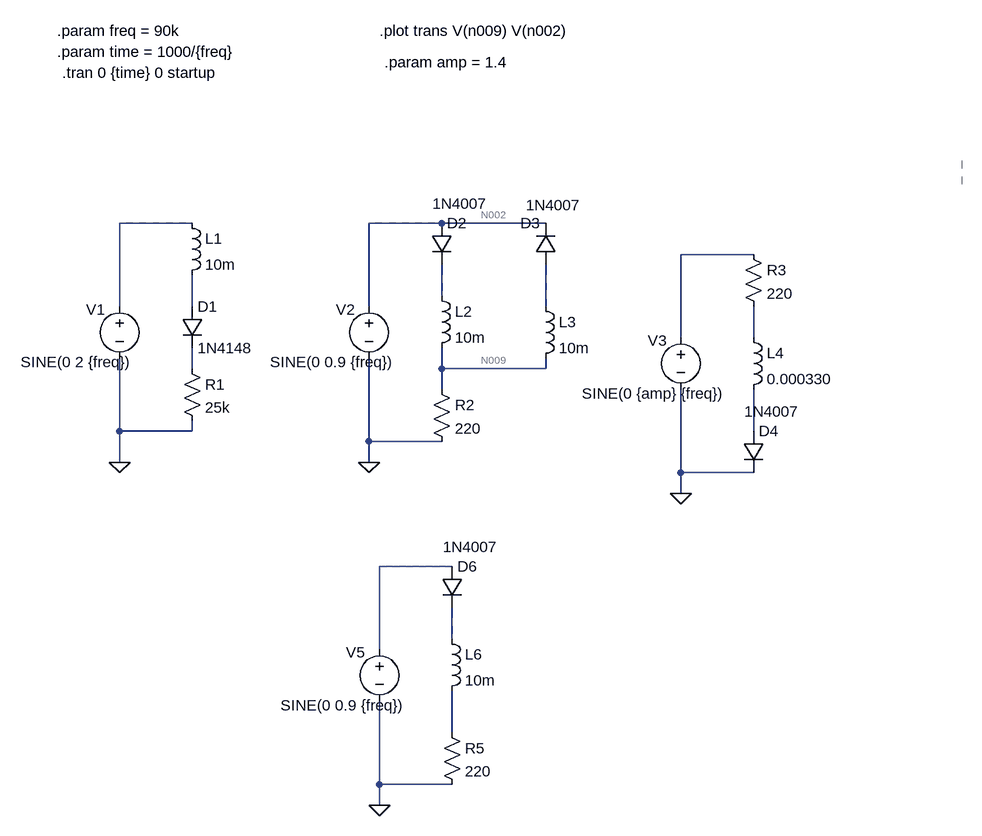
[diagram p0: schematic Draft1.asc]
Draft1.asc, the LTspice schematic file:
Version 4
SHEET 1 1500 1248
WIRE 272 272 160 272
WIRE 656 272 544 272
WIRE 816 272 656 272
WIRE 1136 320 1024 320
WIRE 656 384 656 336
WIRE 160 400 160 272
WIRE 272 400 272 352
WIRE 544 400 544 272
WIRE 816 400 816 336
WIRE 1024 448 1024 320
WIRE 1136 448 1136 400
WIRE 272 496 272 464
WIRE 656 496 656 464
WIRE 816 496 816 480
WIRE 816 496 656 496
WIRE 656 528 656 496
WIRE 160 592 160 480
WIRE 272 592 272 576
WIRE 272 592 160 592
WIRE 1136 592 1136 528
WIRE 544 608 544 480
WIRE 656 608 544 608
WIRE 160 640 160 592
WIRE 544 640 544 608
WIRE 1024 656 1024 528
WIRE 1136 656 1024 656
WIRE 1024 688 1024 656
WIRE 672 800 560 800
WIRE 672 912 672 864
WIRE 560 928 560 800
WIRE 672 1056 672 992
WIRE 560 1136 560 1008
WIRE 672 1136 560 1136
WIRE 560 1168 560 1136
FLAG 160 640 0
FLAG 544 640 0
FLAG 1024 688 0
FLAG 560 1168 0
SYMBOL diode 256 400 R0
SYMATTR InstName D1
SYMATTR Value 1N4148
SYMBOL res 256 480 R0
SYMATTR InstName R1
SYMATTR Value 25k
SYMBOL ind 256 256 R0
SYMATTR InstName L1
SYMATTR Value 10m
SYMBOL voltage 160 384 R0
WINDOW 0 -51 21 Left 2
WINDOW 3 -152 102 Left 2
SYMATTR InstName V1
SYMATTR Value SINE(0 2 {freq})
SYMBOL diode 640 272 R0
WINDOW 3 2 -30 Left 2
SYMATTR Value 1N4007
SYMATTR InstName D2
SYMBOL res 640 512 R0
SYMATTR InstName R2
SYMATTR Value 220
SYMBOL ind 640 368 R0
SYMATTR InstName L2
SYMATTR Value 10m
SYMBOL voltage 544 384 R0
WINDOW 0 -51 21 Left 2
WINDOW 3 -152 102 Left 2
SYMATTR InstName V2
SYMATTR Value SINE(0 0.9 {freq})
SYMBOL diode 832 336 R180
WINDOW 0 24 64 Left 2
WINDOW 3 -38 92 Left 2
SYMATTR InstName D3
SYMATTR Value 1N4007
SYMBOL ind 800 384 R0
SYMATTR InstName L3
SYMATTR Value 10m
SYMBOL diode 1120 592 R0
WINDOW 3 2 -30 Left 2
SYMATTR Value 1N4007
SYMATTR InstName D4
SYMBOL res 1120 304 R0
SYMATTR InstName R3
SYMATTR Value 220
SYMBOL ind 1120 432 R0
SYMATTR InstName L4
SYMATTR Value 0.000330
SYMBOL voltage 1024 432 R0
WINDOW 0 -51 21 Left 2
WINDOW 3 -152 102 Left 2
SYMATTR InstName V3
SYMATTR Value SINE(0 {amp} {freq})
SYMBOL diode 656 800 R0
WINDOW 3 2 -30 Left 2
SYMATTR Value 1N4007
SYMATTR InstName D6
SYMBOL res 656 1040 R0
SYMATTR InstName R5
SYMATTR Value 220
SYMBOL ind 656 896 R0
SYMATTR InstName L6
SYMATTR Value 10m
SYMBOL voltage 560 912 R0
WINDOW 0 -51 21 Left 2
WINDOW 3 -152 102 Left 2
SYMATTR InstName V5
SYMATTR Value SINE(0 0.9 {freq})
TEXT 72 40 Left 2 !.tran 0 {time} 0 startup
TEXT 64 -24 Left 2 !.param freq = 90k
TEXT 64 8 Left 2 !.param time = 1000/{freq}
TEXT 560 -24 Left 2 !.plot trans V(n009) V(n002)
TEXT 568 24 Left 2 !.param amp = 1.4
LINE Normal 272 272 160 272 2
LINE Normal 272 352 272 400 2
LINE Normal 272 464 272 512 2
LINE Normal 656 272 544 272 2
LINE Normal 656 352 656 400 2
LINE Normal 816 352 816 400 2
LINE Normal 1136 320 1024 320 2
LINE Normal 1456 176 1456 224 2
LINE Normal 672 800 560 800 2
LINE Normal 672 880 672 928 2

The netlist it stands for:
* Draft1.asc
D1 N005 N008 1N4148
R1 N008 0 25k
L1 N001 N005 10m
V1 N001 0 SINE(0 2 {freq})
D2 N002 N004 1N4007
R2 N009 0 220
L2 N004 N009 10m
V2 N002 0 SINE(0 0.9 {freq})
D3 N006 N002 1N4007
L3 N006 N009 10m
D4 N010 0 1N4007
R3 N003 N007 220
L4 N007 N010 0.000330
V3 N003 0 SINE(0 {amp} {freq})
D6 N011 N012 1N4007
R5 N013 0 220
L6 N012 N013 10m
V5 N011 0 SINE(0 0.9 {freq})
.model D D
.lib standard.dio
.tran 0 {time} 0 startup
.param freq = 90k
.param time = 1000/{freq}
.plot trans V(n009) V(n002)
.param amp = 1.4
.backanno
.end